# Altium schematic sheet Driver3.SchDoc
size B
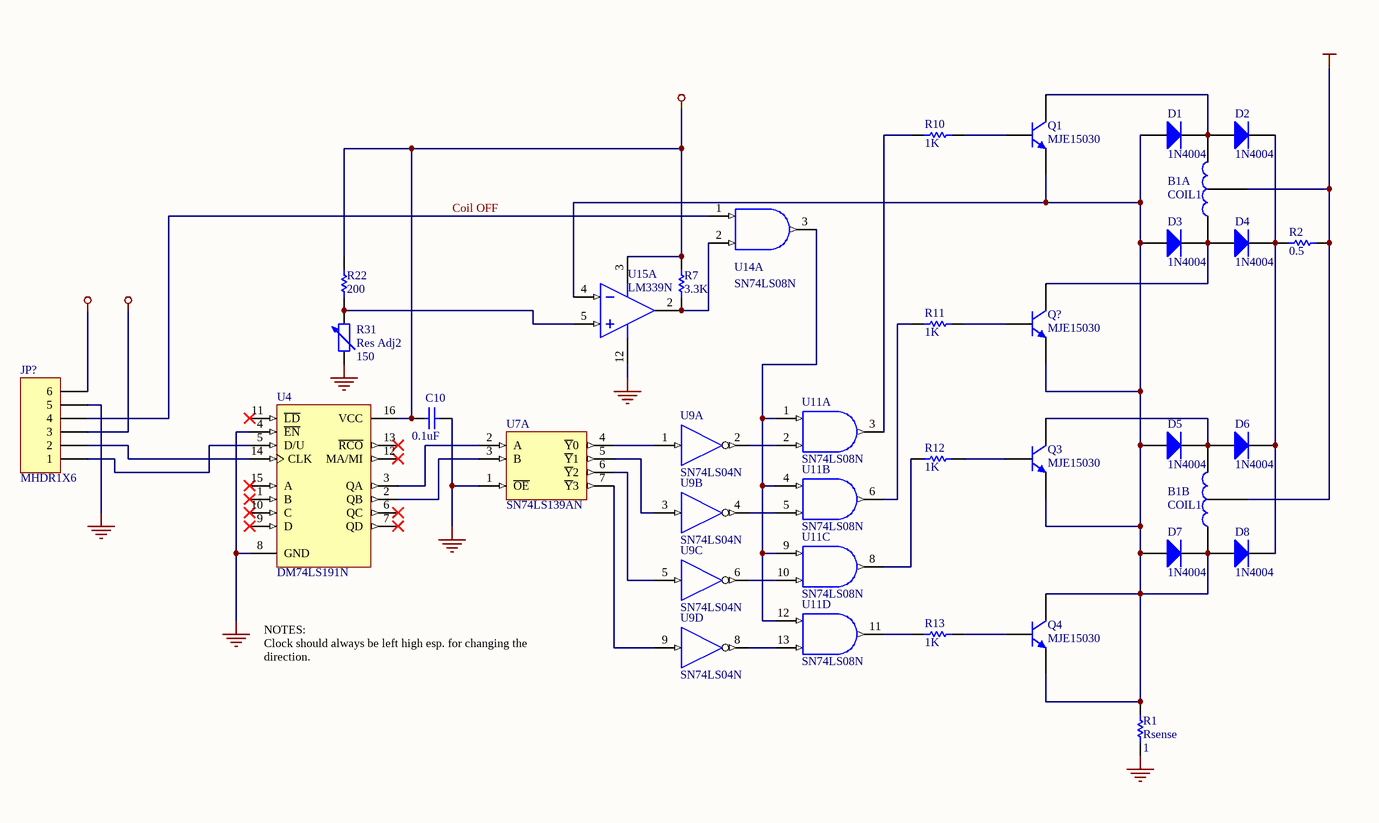
[diagram p0: Driver3.SchDoc]

## Parts
B1A  COIL1
B1B  COIL1
C10  value 0.1uF  [DIP-14/D19.7]  (hidden comment: SN74LS08N)
D1  1N4004  [DIO10.46-5.3x2.8]
D2  1N4004  [DIO10.46-5.3x2.8]
D3  1N4004  [DIO10.46-5.3x2.8]
D4  1N4004  [DIO10.46-5.3x2.8]
D5  1N4004  [DIO10.46-5.3x2.8]
D6  1N4004  [DIO10.46-5.3x2.8]
D7  1N4004  [DIO10.46-5.3x2.8]
D8  1N4004  [DIO10.46-5.3x2.8]
JP?  MHDR1X6  [MHDR1X6]
Q1  MJE15030  [SFM-T3/X1.6V]
Q3  MJE15030  [SFM-T3/X1.6V]
Q4  MJE15030  [SFM-T3/X1.6V]
Q?  MJE15030  [SFM-T3/X1.6V]
R1  Rsense  value 1  [DIO10.46-5.3x2.8]
R2  value 0.5  [DIO10.46-5.3x2.8]  (hidden comment: 1N4004)
R7  value 3.3K  [BCY-W3]  (hidden comment: NPN3)
R10  1K  [AXIAL-0.3]
R11  value 1K  [BCY-W3]  (hidden comment: NPN3)
R12  value 1K  [BCY-W3]  (hidden comment: NPN3)
R13  value 1K  [BCY-W3]  (hidden comment: NPN3)
R22  value 200  [SO-G14/E2]  (hidden comment: DM74LS05M)
R31  Res Adj2  value 150  [AXIAL-0.6]
U4  DM74LS191N  [DIP-16]
U7  SN74LS139AN  [DIP-16/X1.5]  (part A of 2)
U9  SN74LS04N  [DIP-14/D19.7]  (parts A,B,C,D of 6)
U11  SN74LS08N  [DIP-14/D19.7]  (parts A,B,C,D of 4)
U14  SN74LS08N  [DIP-14/D19.7]  (part A of 4)
U15  LM339N  [DIP-14/D19.7]  (part A of 4)

## Nets
+12V: B1A.3(Supply) B1B.3(Supply) JP?.6 R2.2
GND: C10.1 JP?.5 R1.2 R31.1 U4.4(~{EN}) U4.8(GND) U7.1(~{OE}) U7.8(GND) U9.7(GND) U11.7(GND) U14.7(GND) U15.12(GND)
VCC: U7.16(VCC) U11.14(VCC) U14.14(VCC)
VDD: C10.2 JP?.3 R7.2 R22.2 U4.16(VCC) U9.14(VDD) U15.3(V+)
Coil OFF: JP?.4 U14.1(A)
NetB1A_1: B1A.1 D3.2(K) D4.1(A) Q?.2(C)
NetB1A_2: B1A.2 D1.2(K) D2.1(A) Q1.2(C)
NetB1B_1: B1B.1 D1.1(A) D3.1(A) D5.1(A) D7.1(A) D7.2(K) D8.1(A) Q1.3(E) Q3.3(E) Q4.2(C) Q4.3(E) Q?.3(E) R1.1 U15.4(IN-)
NetB1B_2: B1B.2 D5.2(K) D6.1(A) Q3.2(C)
NetD2_2: D2.2(K) D4.2(K) D6.2(K) D8.2(K) R2.1
NetJP?_1: JP?.1 U4.5(D/U)
NetJP?_2: JP?.2 U4.14(CLK)
NetQ1_1: Q1.1(B) R10.2
NetQ3_1: Q3.1(B) R12.2
NetQ4_1: Q4.1(B) R13.1
NetQ?_1: Q?.1(B) R11.2
NetR7_1: R7.1 U14.2(B) U15.2(OUT)
NetR10_1: R10.1 U11.3(Y)
NetR11_1: R11.1 U11.6(Y)
NetR12_1: R12.1 U11.8(Y)
NetR13_2: R13.2 U11.11(Y)
NetR22_1: R22.1 R31.2 U15.5(IN+)
NetU4_2: U4.2(QB) U7.3(B)
NetU4_3: U4.3(QA) U7.2(A)
NetU7_4: U7.4(~{Y}0) U9.1(IN)
NetU7_5: U7.5(~{Y}1) U9.3(IN)
NetU7_6: U7.6(~{Y}2) U9.5(IN)
NetU7_7: U7.7(~{Y}3) U9.9(IN)
NetU9_2: U9.2(~{OUT}) U11.2(B)
NetU9_4: U9.4(~{OUT}) U11.5(B)
NetU9_6: U9.6(~{OUT}) U11.10(B)
NetU9_8: U9.8(~{OUT}) U11.13(B)
NetU11_1: U11.1(A) U11.4(A) U11.9(A) U11.12(A) U14.3(Y)

Not connected (* = marked no-connect by the designer): U4 1(B)* 6(QC)* 7(QD)* 9(D)* 10(C)* 11(~{LD})* 12(MA/MI)* 13(~{RCO})* 15(A)*

## Notes on the sheet
- NOTES:
  Clock should always be left high esp. for changing the direction.

## Library data of the parts
B1A B1B = Component_1
C10 = cap: Capacitor; Manufacturer: Generic Components; Class I: Passive; Published: 8-Jun-2000; Revision: July-2002: Re-released for DXP Platform.; Publisher: Altium Limited; Class II: Capacitor
D1-D8 = 1N4004: 1.0 Ampere General Purpose Rectifier; Manufacturer: Fairchild Semiconductor; Revision 1: 11-July-2000: SIM Model Added.; Revision 2: July-2002: Re-released for DXP Platform.; Package Information: Latest Revision: Aug-1999; Class I: Discrete; Class II: Rectifier - Standard Recovery; Published: 8-Jun-2000; Datasheet: Latest Revision: 1998; Package Reference: DO-41; Publisher: Altium Limited
JP? = MHDR1X6: Header, 6-Pin; Manufacturer: Generic Components; Class I: Connector; Revision: July-2002: Re-released for DXP Platform.; Publisher: Altium Limited
Q1 Q3 Q4 Q? = MJE15030: Complementary Silicon Plastic Power Transistor; Manufacturer: Motorola; Package Information: Latest Revision: 1997; Class I: Discrete; Class II: BJT - Medium Power; Note: Pin 2 is electrically connected to Pin 4 (TAB); Published: 29-Sep-2000; Revision: July-2002: Re-released for DXP Platform.; Datasheet: Latest Revision: 1995; Package Reference: 221A-06; Publisher: Altium Limited
R1 R2 R7 R11-R13 R22 = res1: Resistor; Manufacturer: Generic Components; Class I: Passive; Published: 8-Jun-2000; Revision: July-2002: Re-released for DXP Platform.; Publisher: Altium Limited; Class II: Resistor
R10 = Res1: Resistor; Manufacturer: Generic Components; Class I: Passive; Published: 8-Jun-2000; Publisher: Altium Limited; Class II: Resistor; Revision: July-2002: Re-released for DXP Platform.; Value: 1K
R31 = Res Adj2: Variable Resistor; Manufacturer: Generic Components; Class I: Passive; Set Position: 0.5; Published: 8-Jun-2000; Revision: July-2002: Re-released for DXP Platform.; Publisher: Altium Limited; Class II: Resistor
U4 = DM74LS191N: Synchronous 4-Bit Up/Down Counter with Mode Control; Manufacturer: National Semiconductor; Class I: Logic; Published: 15-Apr-2002; Datasheet: Latest Revision: May-1989; Package Reference: N16E; Publisher: Altium Limited; Class II: Counter
U7 = SN74LS139AN: Dual 2-Line to 4-Line Decoder / Demultiplexer; Manufacturer: Texas Instruments; Revision 1: 12-July-2000: SIM Model Added.; Revision 2: July-2002: Re-released for DXP Platform.; Class I: Logic; Published: 8-Jun-2000; Datasheet: Latest Revision: Mar-1988; Package Reference: N016; Publisher: Altium Limited; Class II: Decoder/Demultiplexer
U9 = SN74LS04N: Hex Inverter; Manufacturer: ON Semiconductor; Class I: Logic; Class II: Buffer/Line Driver; Published: 15-Apr-2002; Datasheet: Latest Revision: 1999; Package Reference: 646-06; Publisher: Altium Limited
U11 U14 = SN74LS08N: Quadruple 2-Input Positive-AND Gate; Manufacturer: Texas Instruments; Class I: Logic; Published: 8-Jun-2000; Revision: July-2002: Re-released for DXP Platform.; Datasheet: Latest Revision: Mar-1988; Package Reference: N014; Publisher: Altium Limited; Class II: Gate
U15 = LM339N: Quad Single-Supply Comparator; Manufacturer: Motorola; Class I: Analog; Published: 15-Apr-2002; Datasheet: Linear and Interface Integrated Circuits, DL128 Rev2 (1988); Package Reference: 646-06; Publisher: Altium Limited; Class II: Comparator